# EAGLE design AS3935-EV (EAGLE 7.2.0)
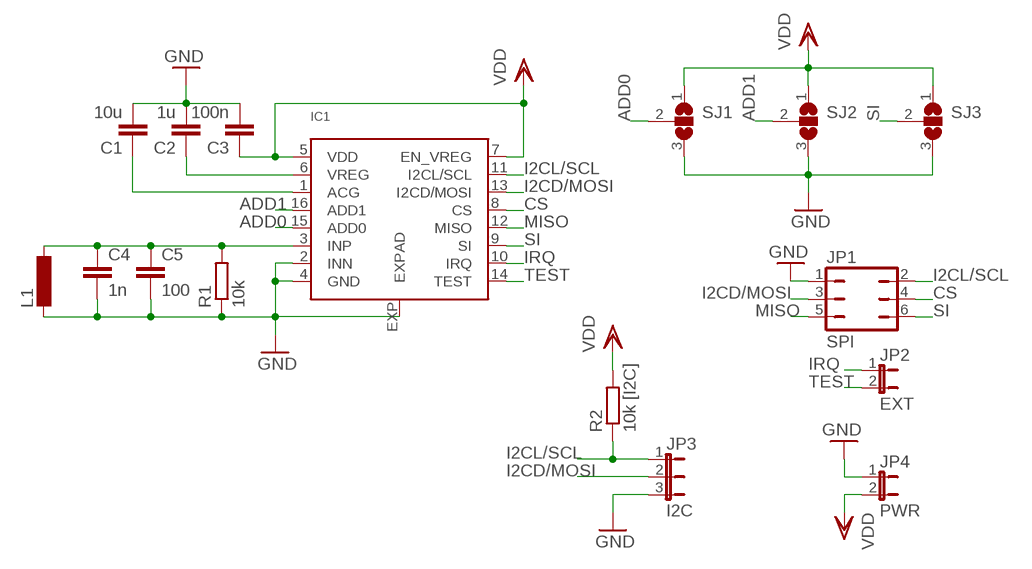
[diagram p0: schematic, sheet 1]

## Parts
C1  10u  C-EUC0805  [C0805]
C2  1u  C-EUC0805  [C0805]
C3  100n  C-EUC0603  [C0603]
C4  1n  C-EUC0603  [C0603]
C5  100  C-EUC0603  [C0603]
IC1  AS3935  [16LDMLPQ]
JP1  SPI  JP3Q  [JP3Q]
JP2  EXT  JP1E  [JP1]
JP3  I2C  JP2E  [JP2]
JP4  PWR  JP1E  [JP1]
L1  COILCRAFT  [COILCRAFT]
R1  10k  R-EU_R0603  [R0603]
R2  10k [I2C]  R-EU_R0603  [R0603]
SJ1  SJ2W  [SJ_2]
SJ2  SJ2W  [SJ_2]
SJ3  SJ2W  [SJ_2]

## Nets
ADD0: IC1.15(ADD0) SJ1.2
ADD1: IC1.16(ADD1) SJ2.2
CS: IC1.8(CS) JP1.4
GND: C1.2 C2.2 C3.2 C4.2 C5.2 IC1.2(INN) IC1.4(GND) IC1.EXP(EXPAD) JP1.1 JP3.3 JP4.1 L1.2 R1.1 SJ1.3 SJ2.3 SJ3.3
I2CD/MOSI: IC1.13(I2CD/MOSI) JP1.3 JP3.2
I2CL/SCL: IC1.11(I2CL/SCL) JP1.2 JP3.1 R2.1
INP: C4.1 C5.1 IC1.3(INP) L1.1 R1.2
IRQ: IC1.10(IRQ) JP2.1
MISO: IC1.12(MISO) JP1.5
N$1: C2.1 IC1.6(VREG)
N$2: C1.1 IC1.1(ACG)
SI: IC1.9(SI) JP1.6 SJ3.2
TEST: IC1.14(TEST) JP2.2
VDD: C3.1 IC1.5(VDD) IC1.7(EN_VREG) JP4.2 R2.2 SJ1.1 SJ2.1 SJ3.1

## Library data of the parts
C1-C5 = rcl:C-EU: CAPACITOR, European symbol
IC1 = AS3935:AS3935
JP1 = jumper:JP3Q: JUMPER
JP2 JP4 = jumper:JP1E: JUMPER
JP3 = jumper:JP2E: JUMPER
L1 = AS3935:COILCRAFT
R1 R2 = rcl:R-EU_: RESISTOR, European symbol
SJ1-SJ3 = jumper:SJ2W: SMD solder JUMPER

## Board
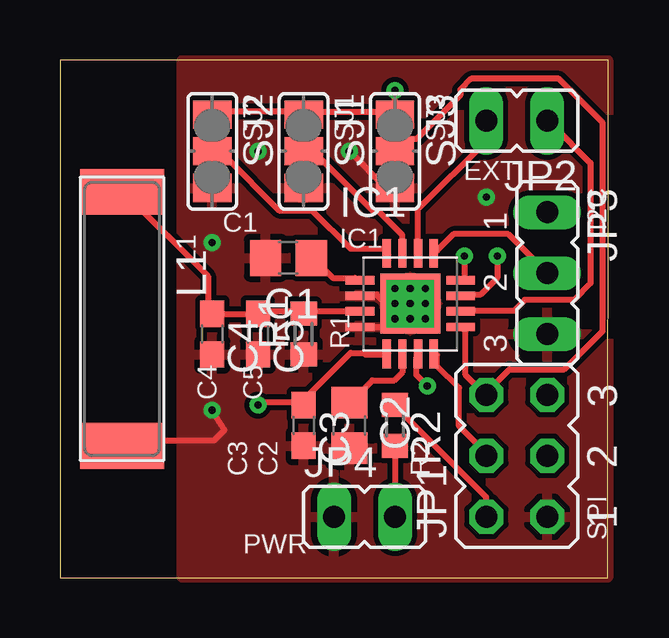
[diagram p1: board, top side]
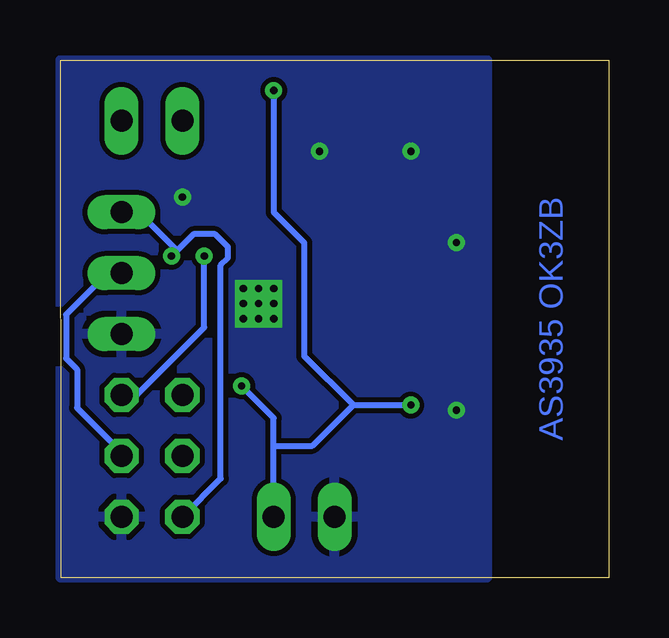
[diagram p2: board, bottom side, seen from below]

Size 22.86 x 21.59 mm. Coordinates in mm from the lower left corner, seen from the top.
Outline: 0,0 22.84,0 22.86,21.59 0,21.59 0,0
Copper layers (1*16): Top 0.035mm / dielectric 1.5mm / Bottom 0.035mm
Design rules "default *": minimum track width 10mil, minimum drill 24mil, track to track 8mil, track to pad 8mil, pad to pad 8mil, via to via 8mil, smd to smd 8mil, copper to edge 0mil, drill to drill 8mil, minimum pad ring 10mil, minimum via ring 8mil, stop-mask expansion 4mil, vias tented up to drill 0mil, thermal gap 10mil

### Footprints (pad centres in the part's own frame; a part is rotated, then mirrored left to right if it is on the bottom)
C0805 = smd 1.3 x 1.5: 1 -0.95,0; 2 0.95,0
C0603 = smd 1.1 x 1: 1 -0.85,0; 2 0.85,0
16LDMLPQ = smd 1.2 x 0.35: 1 -2.1,0.975; 2 -2.1,0.325; 3 -2.1,-0.325; 4 -2.1,-0.975; 9 2.1,-0.975; 10 2.1,-0.325; 11 2.1,0.325; 12 2.1,0.975 | smd 0.35 x 1.2: 5 -0.975,-2.1; 6 -0.325,-2.1; 7 0.325,-2.1; 8 0.975,-2.1; 13 0.975,2.1; 14 0.325,2.1; 15 -0.325,2.1; 16 -0.975,2.1 | smd 2.5 x 2.5: EXP 0,0
JP3Q = drill 0.914 octagon: 1 -2.54,-1.27; 2 -2.54,1.27; 3 0,-1.27; 4 0,1.27; 5 2.54,-1.27; 6 2.54,1.27
JP1 = drill 0.914 long: 1 0,-1.27; 2 0,1.27
JP2 = drill 0.914 long: 1 -2.54,0; 2 0,0; 3 2.54,0
COILCRAFT = smd 1.9 x 3.5: 1 -5.3,0.05; 2 5.3,0.05
R0603 = smd 1 x 1.1: 1 -0.85,0; 2 0.85,0
SJ_2 = smd 1.168 x 1.6: 1 -1.524,0; 2 0,0; 3 1.524,0

### Placement (x,y rotation side)
C1  9.53,13.34 180 top
C2  12.06,6.35 270 top
C3  10.16,6.35 270 top
C4  6.35,10.16 270 top
C5  8.26,10.16 270 top
IC1  14.61,11.43 0 top
JP1  19.05,5.08 90 top
JP2  19.05,19.05 90 top
JP3  20.32,12.7 270 top
JP4  12.7,2.54 270 top
L1  2.54,10.79 270 top
R1  10.16,10.16 90 top
R2  13.97,6.35 270 top
SJ1  10.16,17.78 270 top
SJ2  6.35,17.78 270 top
SJ3  13.97,17.78 270 top

### Tracks (layer width: path | path; a pad name or v marks a point on that pad's centre or on a via)
ADD0
  Top 0.254: SJ1.2 10.29,17.6 10.74,17.6 13.03,15.32 13.26,15.32 14.28,14.29 IC1.15
ADD1
  Top 0.254: IC1.16 13.49,13.72 12.12,13.72 10.52,15.32 9.14,15.32 6.86,17.6 6.4,17.6 SJ2.2
CS
  Top 0.254: IC1.8 15.72,9.3 15.72,8.84 16.64,7.92 16.64,6.33 17.78,5.18 JP1.4
GND  (via drill 0.3)
  Top 0.254: IC1.2 12.52,11.81 13.21,11.81 13.44,11.58 14.58,11.58 IC1.EXP v13.97,11.43 13.97,10.46 IC1.4 | SJ3.3 13.59,16.26 v12.06,17.78 | L1.2 2.74,5.71 6.4,5.71 6.86,6.17 v6.35,6.99
  other vias: 13.97,12.06 15.24,12.06 15.24,10.79 13.97,10.79 8.26,17.78 17.78,15.88 6.35,13.97 14.61,12.06 14.61,11.43 15.24,11.43 14.61,10.79
  pour Top: 5.08,21.59 22.86,21.59 22.86,0 5.08,0
  pour Bottom: 5.08,0 22.86,0 22.86,21.59 5.08,21.59
I2CD/MOSI
  Top 0.254: JP3.2 18.69,14.33 16.41,14.33 15.72,13.64 IC1.13
  Bottom 0.254: JP1.3 20.34,5.26 22.17,7.09 22.17,8.69 22.63,9.14 22.63,10.97 21.03,12.57 20.34,12.57 JP3.2
I2CL/SCL  (via drill 0.3)
  Top 0.254: v18.24,13.41 18.24,12.5 17.55,11.81 16.87,11.81 IC1.11 | JP1.2 17.78,3.35 14.12,7.01 R2.1
  Bottom 0.254: 18.01,13.64 19.61,15.24 JP3.1 | 18.01,13.64 17.32,14.33 16.41,14.33 15.88,13.79 15.88,13.34 16.18,13.03 16.18,4.14 JP1.2 17.78,2.67 | 18.01,13.64 v18.24,13.41
INP
  Top 0.254: IC1.3 12.29,11.12 10.24,11.12 R1.2 10.01,11.12 8.41,11.12 C5.1 8.23,10.97 6.4,10.97 C4.1 6.17,11.2 6.17,12.57 2.74,16 L1.1
IRQ
  Top 0.254: IC1.10 16.87,11.12 18.92,11.12 19.38,11.58 21.44,11.58 22.12,12.27 22.12,17.3 20.52,18.9 JP2.1
MISO  (via drill 0.3)
  Top 0.254: v16.87,13.41 16.87,12.5 IC1.12
  Bottom 0.254: v16.87,13.41 16.87,10.44 19.68,7.62 JP1.5
N$1
  Top 0.254: 12.06,7.01 C2.1 12.12,7.32 13.03,8.23 13.95,8.23 14.28,8.56 IC1.6
N$2
  Top 0.254: IC1.1 12.29,12.5 11.38,12.5 10.69,13.18 C1.1
SI
  Top 0.254: IC1.9 16.92,10.29 16.92,8.46 17.6,7.77 JP1.6 17.83,7.77 18.75,8.69 21.03,8.69 22.63,10.29 22.63,18.97 20.8,20.8 17.14,20.8 16.69,20.34 16.69,20.12 14.86,18.29 14.63,18.29 14.17,17.83 SJ3.2
TEST
  Top 0.254: JP2.2 17.78,18.21 14.93,15.36 IC1.14
VDD  (via drill 0.3)
  Top 0.254: 12.8,9.3 13.66,9.3 IC1.5 | 12.8,9.3 12.75,9.3 | SJ2.1 6.4,19.43 10.06,19.43 SJ1.1 10.29,19.43 13.95,19.43 SJ3.1 v13.97,20.32 | v15.32,8 14.86,8.46 14.86,9.14 IC1.7 | 13.95,5.49 R2.2 JP4.2 | 10.06,7.32 12.12,9.37 12.8,9.37 12.8,9.3 | 10.06,7.32 C3.1 | 10.06,7.32 8.37,7.32 v8.26,7.2
  Bottom 0.254: v13.97,20.32 13.97,15.24 12.7,13.97 12.7,9.25 10.65,7.2 | 10.65,7.2 v8.26,7.2 | 15.24,7.92 v15.32,8 13.97,6.66 R2.2 | JP4.2 R2.2 | R2.2 12.35,5.5 10.65,7.2

### Text on the board
Bottom: AS3935 OK3ZB
_tNames: SJ2 | SJ1 | SJ3 | EXT | I2C | C1 | L1 | IC1 | R1 | C4 | C5 | C3 | C2 | R2 | SPI | PWR